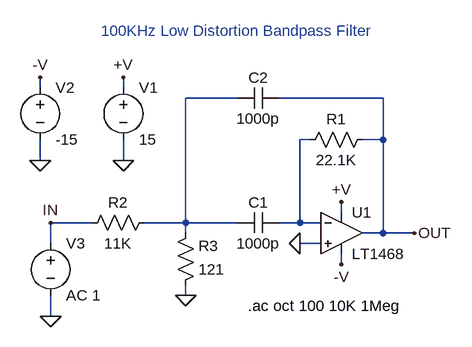
[diagram p0: schematic 1468.asc]
1468.asc, the LTspice schematic file:
Version 4
SHEET 1 896 680
WIRE -224 16 -224 0
WIRE -96 16 -96 0
WIRE 80 32 0 32
WIRE 304 32 144 32
WIRE 192 96 176 96
WIRE 304 96 304 32
WIRE 304 96 272 96
WIRE -224 128 -224 96
WIRE -96 128 -96 96
WIRE 240 208 240 192
WIRE -144 224 -208 224
WIRE 0 224 0 32
WIRE 0 224 -64 224
WIRE 80 224 0 224
WIRE 176 224 176 96
WIRE 176 224 144 224
WIRE 208 224 176 224
WIRE 0 240 0 224
WIRE 304 240 304 96
WIRE 304 240 272 240
WIRE 352 240 304 240
WIRE -208 256 -208 224
WIRE 208 256 176 256
WIRE 240 288 240 272
WIRE 0 336 0 320
WIRE -208 368 -208 336
FLAG -96 128 0
FLAG 240 192 +V
FLAG -96 0 +V
FLAG 240 288 -V
FLAG -224 128 0
FLAG -224 0 -V
FLAG -208 368 0
FLAG 176 256 0
FLAG 0 336 0
FLAG 352 240 OUT
FLAG -208 224 IN
SYMBOL voltage -96 0 R0
SYMATTR InstName V1
SYMATTR Value 15
SYMBOL voltage -224 0 R0
SYMATTR InstName V2
SYMATTR Value -15
SYMBOL res 288 80 R90
WINDOW 0 0 56 VBottom 0
WINDOW 3 32 56 VTop 0
SYMATTR InstName R1
SYMATTR Value 22.1K
SYMBOL res -48 208 R90
WINDOW 0 0 56 VBottom 0
WINDOW 3 32 56 VTop 0
SYMATTR InstName R2
SYMATTR Value 11K
SYMBOL voltage -208 240 R0
SYMATTR InstName V3
SYMATTR Value AC 1
SYMBOL opamps\\LT1468 240 176 R0
SYMATTR InstName U1
SYMBOL res -16 336 M180
WINDOW 0 36 76 Left 0
WINDOW 3 36 40 Left 0
SYMATTR InstName R3
SYMATTR Value 121
SYMBOL cap 144 208 R90
WINDOW 0 0 32 VBottom 0
WINDOW 3 32 32 VTop 0
SYMATTR InstName C1
SYMATTR Value 1000p
SYMBOL cap 144 16 R90
WINDOW 0 0 32 VBottom 0
WINDOW 3 32 32 VTop 0
SYMATTR InstName C2
SYMATTR Value 1000p
TEXT 96 352 Left 0 !.ac oct 100 10K 1Meg
TEXT 80 -56 Bottom 0 ;100KHz Low Distortion Bandpass Filter

The netlist it stands for:
* 1468.asc
V1 +V 0 15
V2 -V 0 -15
R1 OUT N002 22.1K
R2 N001 IN 11K
V3 IN 0 AC 1
XU1 0 N002 +V -V OUT LT1468  ; pins In+ In- V+ V- OUT
R3 0 N001 121
C1 N002 N001 1000p
C2 OUT N001 1000p
.ac oct 100 10K 1Meg
* 100KHz Low Distortion Bandpass Filter
.backanno
.end